# EAGLE design BikeNavigation (EAGLE 7.4.0)
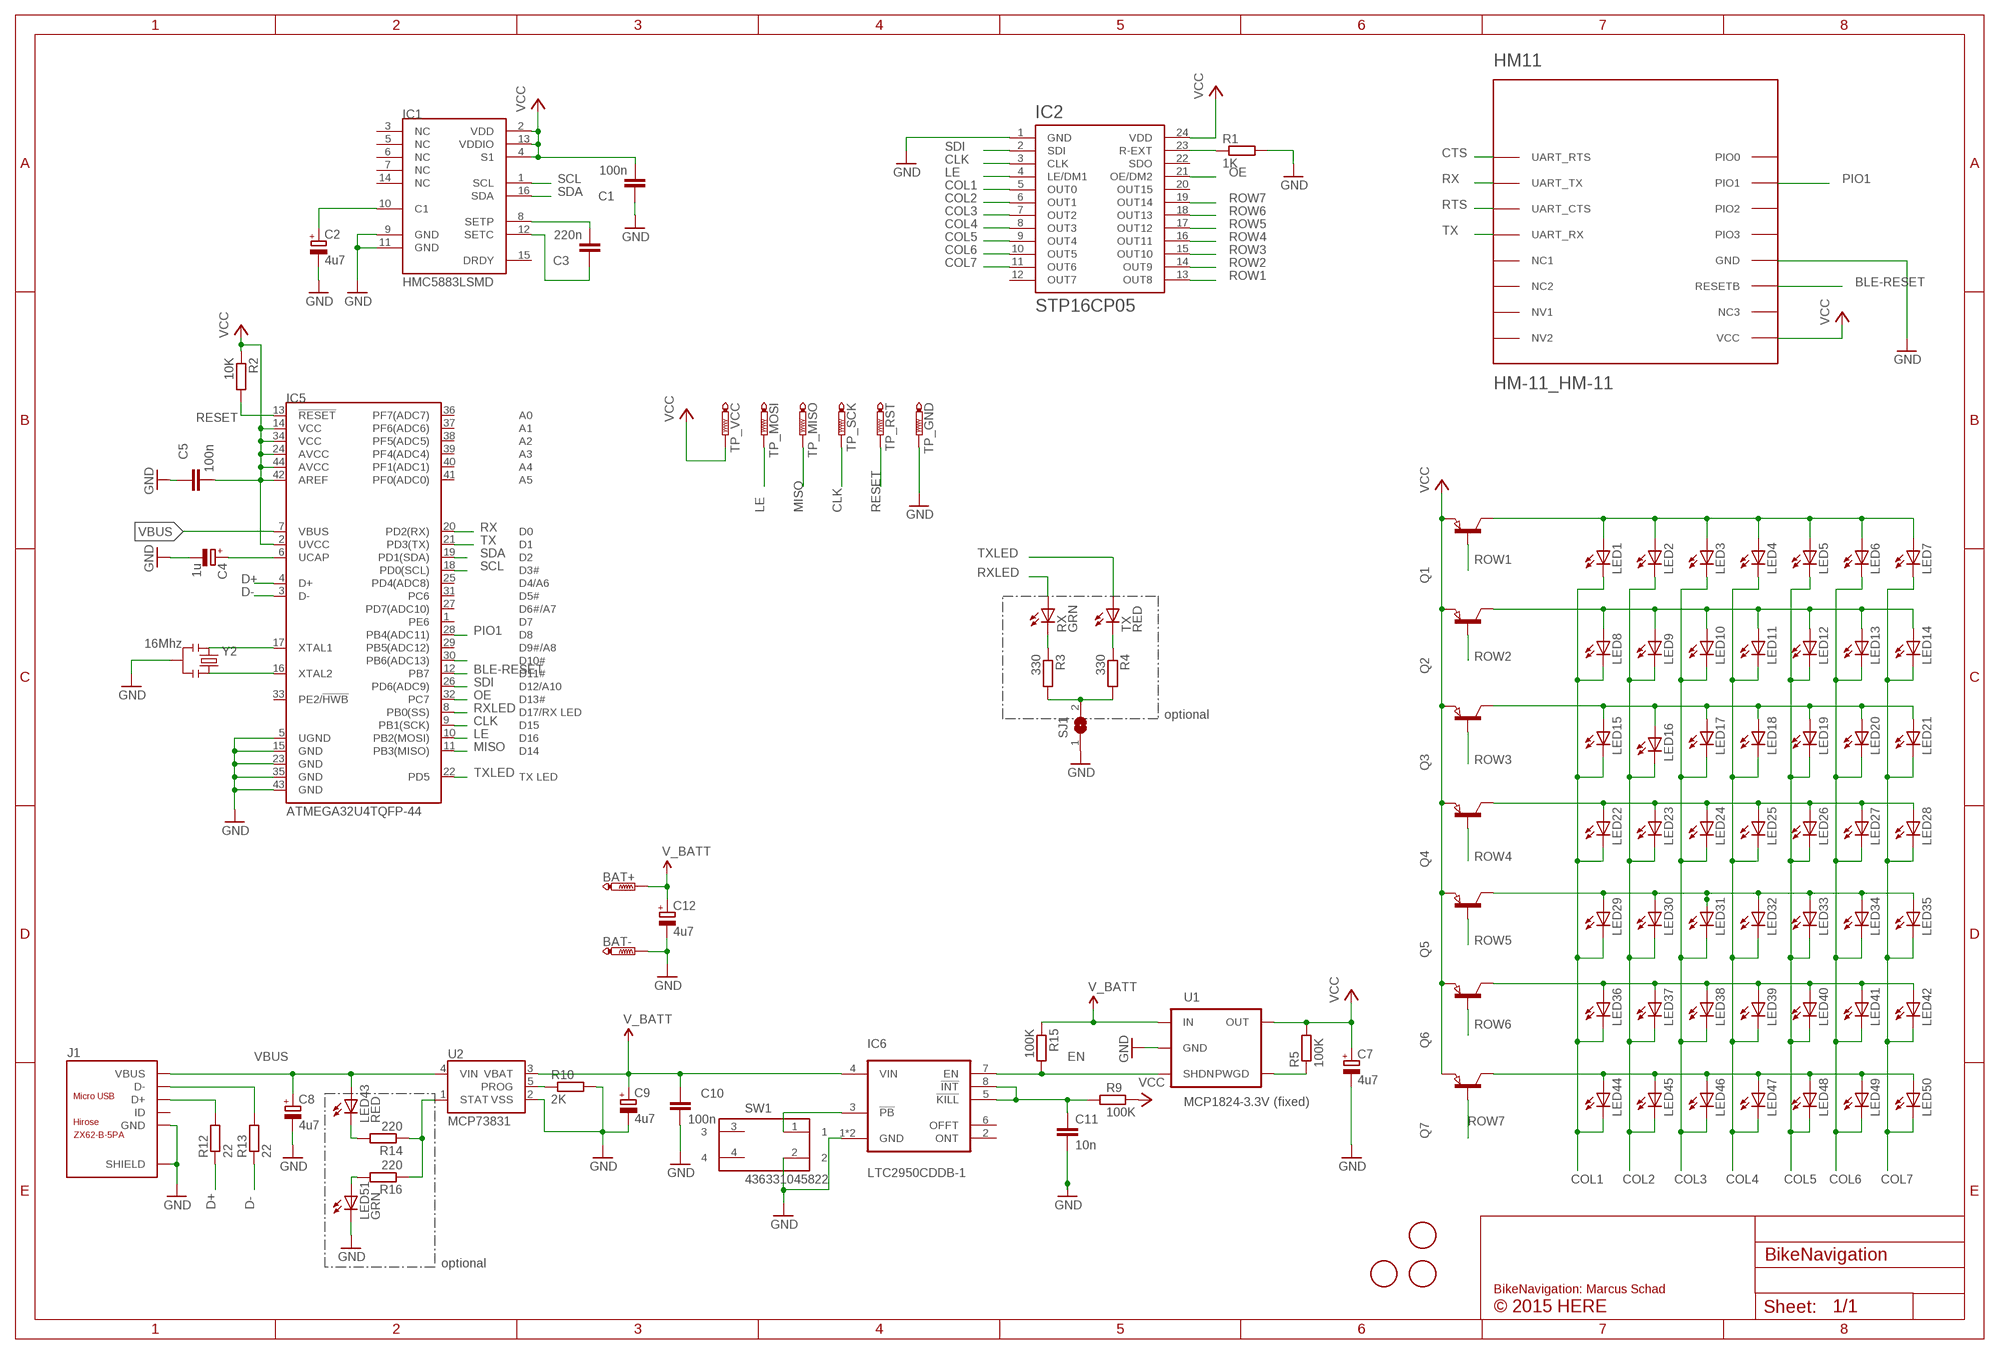
[diagram p0: schematic, sheet 1]

## Parts
BAT+  PTR1TP20SQ  [TP20SQ]
BAT-  PTR1TP20SQ  [TP20SQ]
C1  100n  C-EUC0402  [C0402]
C2  4u7  CPOL-EUSMCA  [SMC_A]
C3  220n  C-EUC0402  [C0402]
C4  1u  CPOL-EUSMCA  [SMC_A]
C5  100n  C-EUC0402  [C0402]
C7  4u7  CPOL-EUSMCA  [SMC_A]
C8  4u7  CPOL-EUSMCA  [SMC_A]
C9  4u7  CPOL-EUSMCA  [SMC_A]
C10  100n  C-EUC0402  [C0402]
C11  10n  C-EUC0402  [C0402]
C12  4u7  CPOL-EUSMCA  [SMC_A]
HM11  HM-11_HM-11  [HM-11_HM-11]
IC1  HMC5883LSMD  [16LPCC]
IC2  STP16CP05  [TSSOP24]
IC5  ATMEGA32U4TQFP-44  [TQFP44]
IC6  LTC2950CDDB-1  LTC2950-1DFN(3X2)  [DDB-8]
J1  MICRO-USB-SMD(ZX62-B-5PA)  [MICRO-USB5+6P-SMD-0.65-AB]
LED1  LEDCHIP-LED0603  [CHIP-LED0603]
LED2  LEDCHIP-LED0603  [CHIP-LED0603]
LED3  LEDCHIP-LED0603  [CHIP-LED0603]
LED4  LEDCHIP-LED0603  [CHIP-LED0603]
LED5  LEDCHIP-LED0603  [CHIP-LED0603]
LED6  LEDCHIP-LED0603  [CHIP-LED0603]
LED7  LEDCHIP-LED0603  [CHIP-LED0603]
LED8  LEDCHIP-LED0603  [CHIP-LED0603]
LED9  LEDCHIP-LED0603  [CHIP-LED0603]
LED10  LEDCHIP-LED0603  [CHIP-LED0603]
LED11  LEDCHIP-LED0603  [CHIP-LED0603]
LED12  LEDCHIP-LED0603  [CHIP-LED0603]
LED13  LEDCHIP-LED0603  [CHIP-LED0603]
LED14  LEDCHIP-LED0603  [CHIP-LED0603]
LED15  LEDCHIP-LED0603  [CHIP-LED0603]
LED16  LEDCHIP-LED0603  [CHIP-LED0603]
LED17  LEDCHIP-LED0603  [CHIP-LED0603]
LED18  LEDCHIP-LED0603  [CHIP-LED0603]
LED19  LEDCHIP-LED0603  [CHIP-LED0603]
LED20  LEDCHIP-LED0603  [CHIP-LED0603]
LED21  LEDCHIP-LED0603  [CHIP-LED0603]
LED22  LEDCHIP-LED0603  [CHIP-LED0603]
LED23  LEDCHIP-LED0603  [CHIP-LED0603]
LED24  LEDCHIP-LED0603  [CHIP-LED0603]
LED25  LEDCHIP-LED0603  [CHIP-LED0603]
LED26  LEDCHIP-LED0603  [CHIP-LED0603]
LED27  LEDCHIP-LED0603  [CHIP-LED0603]
LED28  LEDCHIP-LED0603  [CHIP-LED0603]
LED29  LEDCHIP-LED0603  [CHIP-LED0603]
LED30  LEDCHIP-LED0603  [CHIP-LED0603]
LED31  LEDCHIP-LED0603  [CHIP-LED0603]
LED32  LEDCHIP-LED0603  [CHIP-LED0603]
LED33  LEDCHIP-LED0603  [CHIP-LED0603]
LED34  LEDCHIP-LED0603  [CHIP-LED0603]
LED35  LEDCHIP-LED0603  [CHIP-LED0603]
LED36  LEDCHIP-LED0603  [CHIP-LED0603]
LED37  LEDCHIP-LED0603  [CHIP-LED0603]
LED38  LEDCHIP-LED0603  [CHIP-LED0603]
LED39  LEDCHIP-LED0603  [CHIP-LED0603]
LED40  LEDCHIP-LED0603  [CHIP-LED0603]
LED41  LEDCHIP-LED0603  [CHIP-LED0603]
LED42  LEDCHIP-LED0603  [CHIP-LED0603]
LED43  RED  LEDSML0805  [SML0805]
LED44  LEDCHIP-LED0603  [CHIP-LED0603]
LED45  LEDCHIP-LED0603  [CHIP-LED0603]
LED46  LEDCHIP-LED0603  [CHIP-LED0603]
LED47  LEDCHIP-LED0603  [CHIP-LED0603]
LED48  LEDCHIP-LED0603  [CHIP-LED0603]
LED49  LEDCHIP-LED0603  [CHIP-LED0603]
LED50  LEDCHIP-LED0603  [CHIP-LED0603]
LED51  GRN  LEDSML0805  [SML0805]
Q1  PNP-TRANSISTOR_SOT23  [SOT23]
Q2  PNP-TRANSISTOR_SOT23  [SOT23]
Q3  PNP-TRANSISTOR_SOT23  [SOT23]
Q4  PNP-TRANSISTOR_SOT23  [SOT23]
Q5  PNP-TRANSISTOR_SOT23  [SOT23]
Q6  PNP-TRANSISTOR_SOT23  [SOT23]
Q7  PNP-TRANSISTOR_SOT23  [SOT23]
R1  1K  R-EU_R0402  [R0402]
R2  10K  R-EU_R0402  [R0402]
R3  330  R-EU_R0402  [R0402]
R4  330  R-EU_R0402  [R0402]
R5  100K  R-EU_R0402  [R0402]
R9  100K  R-EU_R0402  [R0402]
R10  2K  R-EU_R0402  [R0402]
R12  22  R-EU_R0402  [R0402]
R13  22  R-EU_R0402  [R0402]
R14  220  R-EU_R0402  [R0402]
R15  100K  R-EU_R0402  [R0402]
R16  220  R-EU_R0402  [R0402]
RX  GRN  LEDCHIP-LED0603  [CHIP-LED0603]
SJ1  SJ  [SJ]
SW1  436331045822  [436331045822]
TP_GND  PTR1TP20SQ  [TP20SQ]
TP_MISO  PTR1TP20SQ  [TP20SQ]
TP_MOSI  PTR1TP20SQ  [TP20SQ]
TP_RST  PTR1TP20SQ  [TP20SQ]
TP_SCK  PTR1TP20SQ  [TP20SQ]
TP_VCC  PTR1TP20SQ  [TP20SQ]
TX  RED  LEDCHIP-LED0603  [CHIP-LED0603]
U1  MCP1824-3.3V (fixed)  V_REG_LDOSMD  [SOT23-5]
U2  MCP73831  [SOT23-5]
U$1  FIDUCIAL  [FIDUCIAL_1MM]
U$2  FIDUCIAL  [FIDUCIAL_1MM]
U$3  FIDUCIAL  [FIDUCIAL_1MM]
Y2  16Mhz  RESONATORSMD  [RESONATOR-SMD]

## Nets
$NS100: LED1.A LED2.A LED3.A LED4.A LED5.A LED6.A LED7.A Q1.3(C)
$NS101: LED8.A LED9.A LED10.A LED11.A LED12.A LED13.A LED14.A Q2.3(C)
$NS102: LED15.A LED16.A LED17.A LED18.A LED19.A LED20.A LED21.A Q3.3(C)
$NS104: LED22.A LED23.A LED24.A LED25.A LED26.A LED27.A LED28.A Q4.3(C)
$NS105: LED29.A LED30.A LED31.A LED32.A LED33.A LED34.A LED35.A Q5.3(C)
$NS107: LED36.A LED37.A LED38.A LED39.A LED40.A LED41.A LED42.A Q6.3(C)
$NS109: LED44.A LED45.A LED46.A LED47.A LED48.A LED49.A LED50.A Q7.3(C)
BLE-RESET: HM11.RESETB IC5.12(PB7)
CLK: IC2.3(CLK) IC5.9(PB1(SCK)) TP_SCK.TP
COL1: IC2.5(OUT0) LED1.C LED8.C LED15.C LED22.C LED29.C LED36.C LED44.C
COL2: IC2.6(OUT1) LED2.C LED9.C LED16.C LED23.C LED30.C LED37.C LED45.C
COL3: IC2.7(OUT2) LED3.C LED10.C LED17.C LED24.C LED31.C LED38.C LED46.C
COL4: IC2.8(OUT3) LED4.C LED11.C LED18.C LED25.C LED32.C LED39.C LED47.C
COL5: IC2.9(OUT4) LED5.C LED12.C LED19.C LED26.C LED33.C LED40.C LED48.C
COL6: IC2.10(OUT5) LED6.C LED13.C LED20.C LED27.C LED34.C LED41.C LED49.C
COL7: IC2.11(OUT6) LED7.C LED14.C LED21.C LED28.C LED35.C LED42.C LED50.C
CTS: HM11.UART_RTS
D+: IC5.4(D+) R12.1
D-: IC5.3(D-) R13.1
EN: IC6.7(EN) R15.2 U1.3(SHDN)
GND: BAT-.TP C1.1 C2.- C4.- C5.1 C7.- C8.- C9.- C10.2 C11.2 C12.- HM11.GND IC1.9(GND) IC1.11(GND) IC2.1(GND) IC5.5(UGND) IC5.15(GND) IC5.23(GND) IC5.35(GND) IC5.43(GND) IC6.1(GND) IC6.TPAD(GND) J1.5(GND) J1.P1(SHIELD) J1.P2(SHIELD) J1.P3(SHIELD) J1.P4(SHIELD) J1.P5(SHIELD) J1.P6(SHIELD) LED51.C R1.2 R10.2 SJ1.1 SW1.2 TP_GND.TP U1.2(GND) U2.2(VSS) Y2.2
LE: IC2.4(LE/DM1) IC5.10(PB2(MOSI)) TP_MOSI.TP
MISO: IC5.11(PB3(MISO)) TP_MISO.TP
N$1: R5.1 U1.4(PWGD)
N$2: R3.1 RX.C
N$3: R4.1 TX.C
N$4: IC2.23(R-EXT) R1.1
N$5: IC5.30(PB6(ADC13))
N$7: R3.2 R4.2 SJ1.2
N$11: C4.+ IC5.6(UCAP)
N$23: LED43.C R14.2
N$26: LED51.A R16.2
N$27: J1.3(D+) R12.2
N$28: C2.+ IC1.10(C1)
N$30: J1.2(D-) R13.2
N$33: IC6.3(!PB) SW1.1
N$34: C11.1 IC6.5(!KILL) IC6.8(!INT) R9.1
N$38: C3.2 IC1.8(SETP)
N$39: C3.1 IC1.12(SETC)
OE: IC2.21(OE/DM2) IC5.32(PC7)
PIO1: HM11.PIO1 IC5.28(PB4(ADC11))
PROG: R10.1 U2.5(PROG)
RESET: IC5.13(!RESET) R2.2 TP_RST.TP
ROW1: IC2.13(OUT8) Q1.1(B)
ROW2: IC2.14(OUT9) Q2.1(B)
ROW3: IC2.15(OUT10) Q3.1(B)
ROW4: IC2.16(OUT11) Q4.1(B)
ROW5: IC2.17(OUT12) Q5.1(B)
ROW6: IC2.18(OUT13) Q6.1(B)
ROW7: IC2.19(OUT14) Q7.1(B)
RTS: HM11.UART_CTS
RX: HM11.UART_TX IC5.20(PD2(RX))
RXLED: IC5.8(PB0(SS)) RX.A
SCL: IC1.1(SCL) IC5.18(PD0(SCL))
SDA: IC1.16(SDA) IC5.19(PD1(SDA))
SDI: IC2.2(SDI) IC5.26(PD6(ADC9))
STAT: R14.1 R16.1 U2.1(STAT)
TX: HM11.UART_RX IC5.21(PD3(TX))
TXLED: IC5.22(PD5) TX.A
V_BATT: BAT+.TP C9.+ C10.1 C12.+ IC6.4(VIN) R15.1 U1.1(IN) U2.3(VBAT)
VBUS: C8.+ IC5.7(VBUS) J1.1(VBUS) LED43.A U2.4(VIN)
VCC: C1.2 C5.2 C7.+ HM11.VCC IC1.2(VDD) IC1.4(S1) IC1.13(VDDIO) IC2.24(VDD) IC5.2(UVCC) IC5.14(VCC) IC5.24(AVCC) IC5.34(VCC) IC5.42(AREF) IC5.44(AVCC) Q1.2(E) Q2.2(E) Q3.2(E) Q4.2(E) Q5.2(E) Q6.2(E) Q7.2(E) R2.1 R5.2 R9.2 TP_VCC.TP U1.5(OUT)
XTAL1: IC5.17(XTAL1) Y2.1
XTAL2: IC5.16(XTAL2) Y2.3
Unconnected: HM11.NC1 HM11.NC2 HM11.NC3 HM11.NV1 HM11.NV2 HM11.PIO0 HM11.PIO2 HM11.PIO3 IC1.3(NC) IC1.5(NC) IC1.6(NC) IC1.7(NC) IC1.14(NC) IC1.15(DRDY) IC2.12(OUT7) IC2.20(OUT15) IC2.22(SDO) IC5.1(PE6) IC5.25(PD4(ADC8)) IC5.27(PD7(ADC10)) IC5.29(PB5(ADC12)) IC5.31(PC6) IC5.33(PE2/!HWB) IC5.36(PF7(ADC7)) IC5.37(PF6(ADC6)) IC5.38(PF5(ADC5)) IC5.39(PF4(ADC4)) IC5.40(PF1(ADC1)) IC5.41(PF0(ADC0)) IC6.2(ONT) IC6.6(OFFT) J1.4(ID) SW1.3 SW1.4

## Notes on the sheet
- optional
- optional
- BikeNavigation: Marcus Schad
- © 2015 HERE

## Library data of the parts
BAT+ BAT- TP_GND TP_MISO TP_MOSI TP_RST TP_SCK TP_VCC = testpad:PTR1: TEST PIN
C1 C3 C5 C10 = Smartprj:C-EU: CAPACITOR, European symbol; PARTNO: 445-3445-1-ND
C2 C4 C7-C9 C12 = rcl:CPOL-EU: POLARIZED CAPACITOR, European symbol
C11 = Smartprj:C-EU: CAPACITOR, European symbol; PARTNO: 445-1260-1-ND
HM11 = BikeNavigation:HM-11_HM-11
IC1 = SparkFun-Sensors:HMC5883L: 3 Axis Digital Compass IC; PROD_ID: IC-10284
IC2 = BikeNavigation:STP16CP05
IC5 = SparkFun-DigitalIC:ATMEGA32U4: Atmel 44-pin 8-bit Microcontroller with 32KBytes of ISP Flash and USB Controller
IC6 = Smartprj:LTC2950-1: LTC2950-1 Push button ON/OFF Controler LINEAR TECHNOLOGY; PARTNO: LTC2950IDDB-1#TRMPBFCT-ND
J1 = Seeed-OPL-Connector:MICRO-USB-SMD(ZX62-B-5PA): 320010005
LED1-LED51 RX TX = led:LED: LED OSRAM: - CHIPLED LG R971, LG N971, LY N971, LG Q971, LY Q971, LO R971, LY R971 LH N974, LH R974 LS Q976, LO Q976, LY Q976 LO Q996 - Hyper CHIPLED LW Q18S LB Q993, LB Q99A, LB R99A - SideLED LS A670, LO A670, LY A670, LG A670, LP A670 LB A673, LV A673, LT A673, LW A673 LH A674 LY A675 LS A676, LA A676, LO A676, LY A676, LW A676 LS A679, LY A679, LG A679 - Hyper Micro SIDELED® LS Y876, LA Y876, LO Y876, LY Y876 LT Y87S - SmartLED LW L88C, LW L88S LB L89C, LB L89S, LG L890 LS L89K, LO L89K, LY L89K LS L896, LA L896, LO L896, LY L896 - TOPLED LS T670, LO T670, LY T670, LG T670, LP T670 LSG T670, LSP T670, LSY T670, LOP T670, LYG T670 LG T671, LOG T671, LSG T671 LB T673, LV T673, LT T673, LW T673 LH T674 LS T676, LA T676, LO T676, LY T676, LB T676, LH T676, LSB T676, LW T676 LB T67C, LV T67C, LT T67C, LS T67K, LO T67K, LY T67K, LW E67C LS E67B, LA E67B, LO E67B, LY E67B, LB E67C, LV E67C, LT E67C LW T67C LS T679, LY T679, LG T679 LS T770, LO T770, LY T770, LG T770, LP T770 LB T773, LV T773, LT T773, LW T773 LH T774 LS E675, LA E675, LY E675, LS T675 LS T776, LA T776, LO T776, LY T776, LB T776 LHGB T686 LT T68C, LB T68C - Hyper Mini TOPLED® LB M676 - Mini TOPLED Santana® LG M470 LS M47K, LO M47K, LY M47K Source: http://www.osram.convergy.de LUXEON: - LUMILED® LXK2-PW12-R00, LXK2-PW12-S00, LXK2-PW14-U00, LXK2-PW14-V00 LXK2-PM12-R00, LXK2-PM12-S00, LXK2-PM14-U00 LXK2-PE12-Q00, LXK2-PE12-R00, LXK2-PE12-S00, LXK2-PE14-T00, LXK2-PE14-U00 LXK2-PB12-K00, LXK2-PB12-L00, LXK2-PB12-M00, LXK2-PB14-N00, LXK2-PB14-P00, LXK2-PB14-Q00 LXK2-PR12-L00, LXK2-PR12-M00, LXK2-PR14-Q00, LXK2-PR14-R00 LXK2-PD12-Q00, LXK2-PD12-R00, LXK2-PD12-S00 LXK2-PH12-R00, LXK2-PH12-S00 LXK2-PL12-P00, LXK2-PL12-Q00, LXK2-PL12-R00 Source: www.luxeon.com KINGBRIGHT: KA-3528ASYC Source: www.kingbright.com
Q1-Q7 = semicon-smd-ipc:PNP-TRANSISTOR_: PNP TRANSISTOR
R1-R5 R10 R12-R14 R16 = rcl:R-EU_: RESISTOR, European symbol
R9 = Smartprj:R-EU_: RESISTOR, European symbol; PARTNO: P510KJCT-ND
R15 = Smartprj:R-EU_: RESISTOR, European symbol; PARTNO: P100KJCT-ND
SJ1 = jumper:SJ: SMD solder JUMPER
SW1 = Kurzhubtaster:436331045822: WS-TUS-3.5x4.7 mm side push SMD Tact Switch with boss design, 4 pins
U1 = SparkFun-PowerIC2:V_REG_LDO: Voltage Regulator LDO Standard 150mA LDO voltage regulator in SOT-23 layout. Micrel part MIC5205. BP (by-pass) pin is used to lower output noise with 470pF cap.
U2 = SparkFun-PowerIC:MCP73831: Miniature single cell, fully integrated Li-Ion, Li-polymer charge management controller http://ww1.microchip.com/downloads/en/DeviceDoc/20001984g.pdf IC-09995; PROD_ID: IC-09995
U$1-U$3 = adafruit:FIDUCIAL: For use by pick and place machines to calibrate the vision/machine, 1mm By microbuilder.eu
Y2 = SparkFun:RESONATOR: Resonator Small SMD resonator. This is the itty bitty 10/20MHz resonators with built in caps. CSTCE10M0G55 and CSTCE20M0V53. Footprint has been reviewed closely but hasn't been tested yet.; PARTNO: *

## Net classes
0 default: width 0.152 mm, drill 0.457 mm, clearance 0.203 mm
2 gnd: width 0.254 mm, drill 0.61 mm, clearance 0.254 mm

## Board
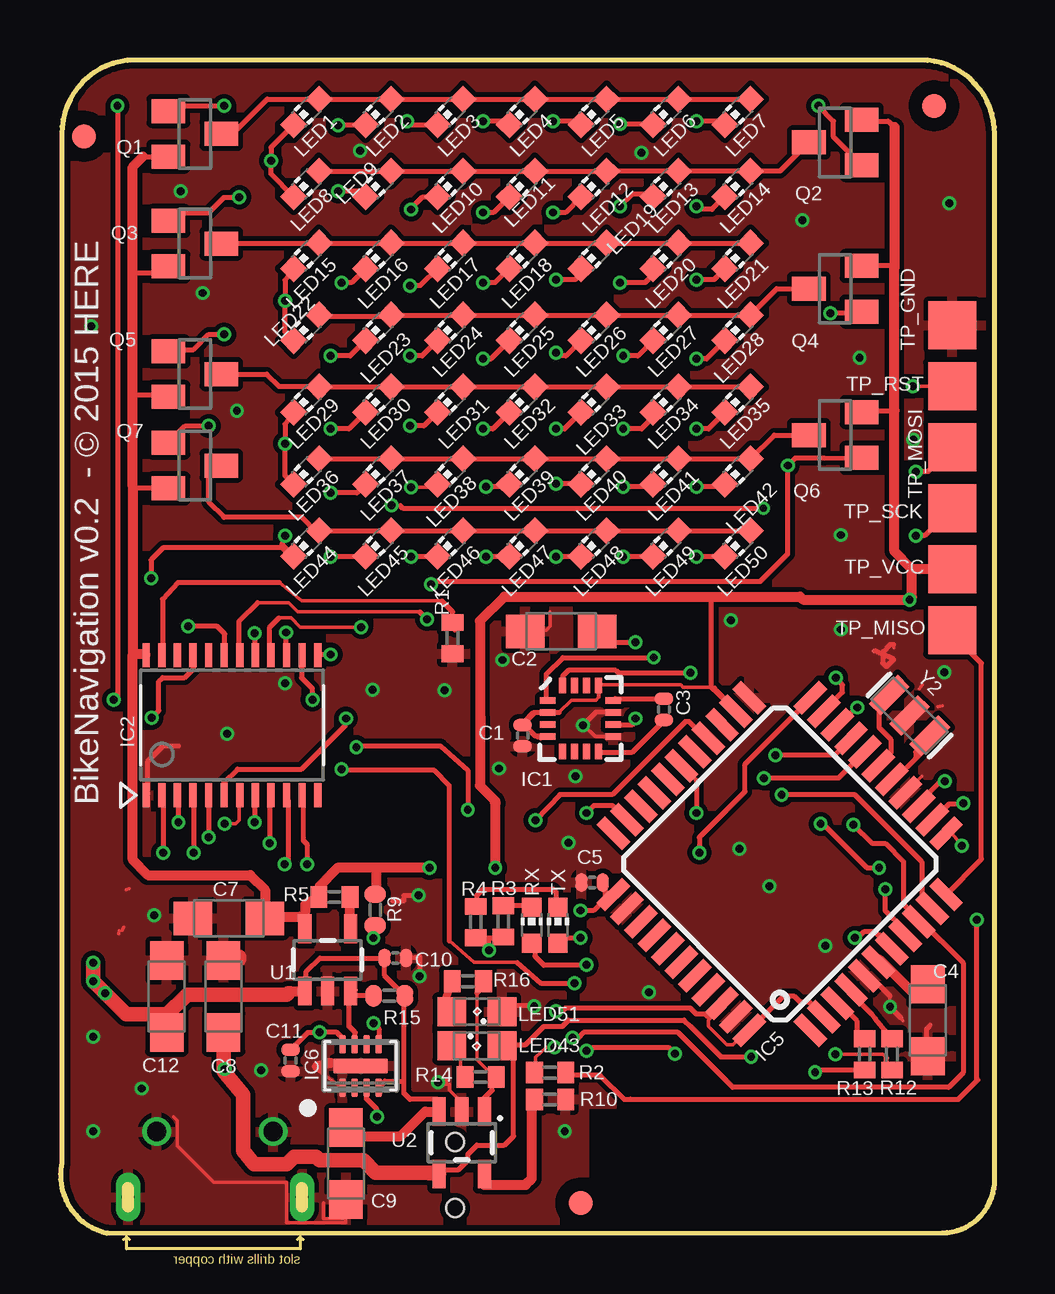
[diagram p1: board, top side]
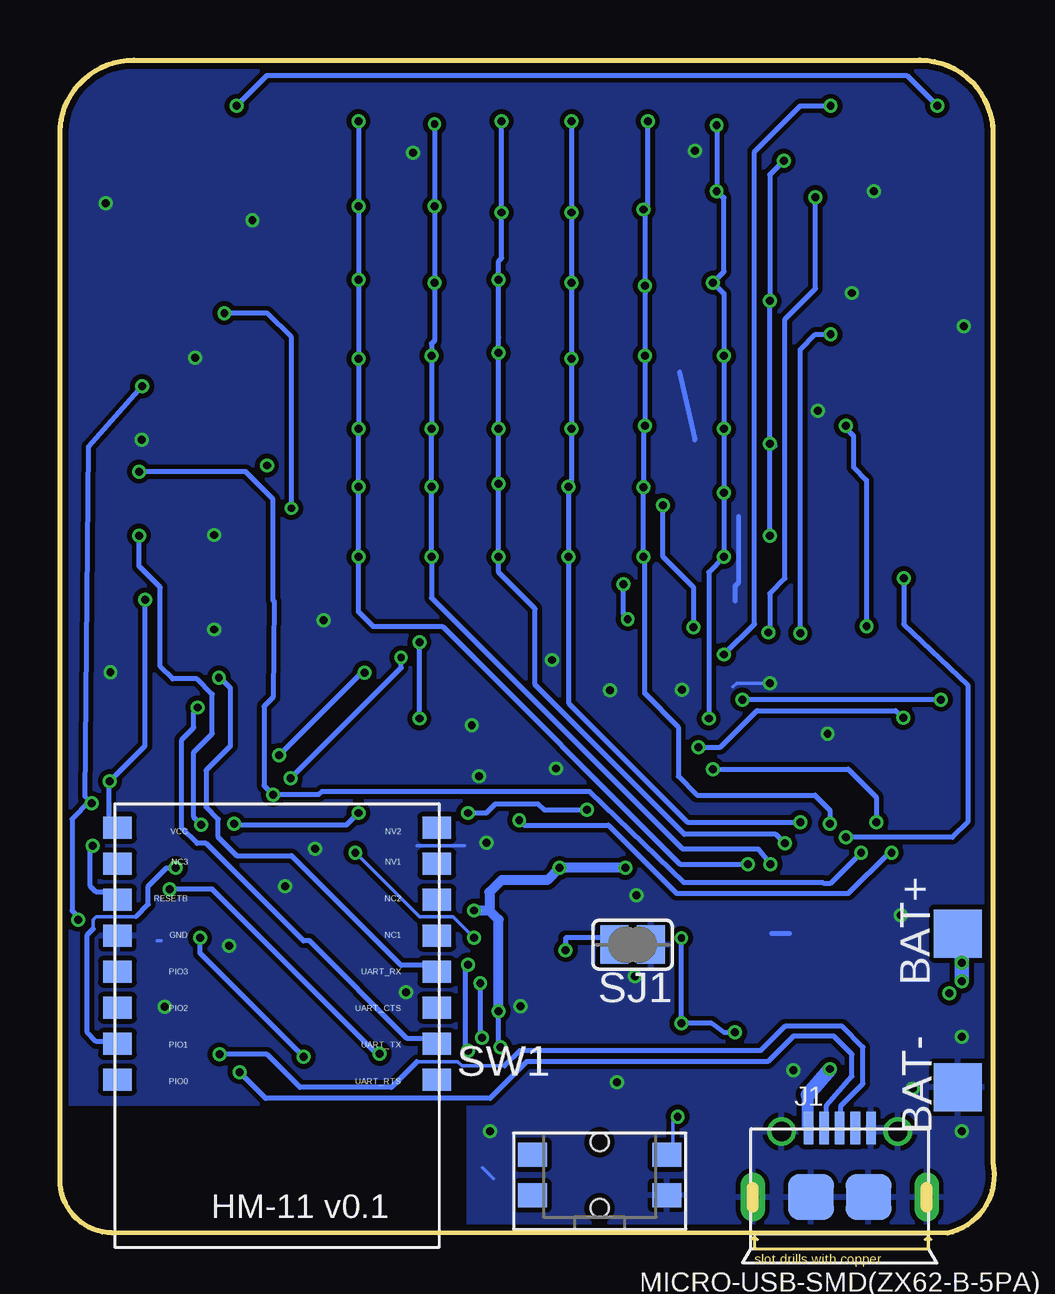
[diagram p2: board, bottom side, seen from below]

Size 38.94 x 48.88 mm. Coordinates in mm from the lower left corner, seen from the top.
Outline: 3.08,48.88 arc90 0.05,45.81 0.05,2.92 arc90 1.95,0 36.76,0.01 arc90 38.94,2.25 38.94,45.8 arc90 35.86,48.88 3.14,48.88 3.08,48.88
Copper layers (1*16): Top 0.018mm / dielectric 1.55mm / Bottom 0.018mm
Design rules "default": minimum track width 0.15mm, minimum drill 0.35mm, track to track 0.15mm, track to pad 0.15mm, pad to pad 0.15mm, via to via 0.15mm, smd to smd 0mil, copper to edge 0.25mm, drill to drill 0.35mm, minimum pad ring 0.175mm, minimum via ring 0.125mm, stop-mask expansion 0mil, vias tented up to drill 0.45mm, thermal gap 0.2mm
bKeepout: area 23.2,0 to 36.7,4.6
tRestrict: area 22.1,-0.4 to 38.8,5.2
bRestrict: area 22,-0.3 to 38.8,5.3

### Footprints (pad centres in the part's own frame; a part is rotated, then mirrored left to right if it is on the bottom)
TP20SQ = smd 2 x 2: TP 0,0
C0402 = smd 0.508 x 0.762: 1 -0.445,0; 2 0.445,0
SMC_A = smd 1.6 x 1.4: + -1.5,0; - 1.5,0
HM-11_HM-11 = smd 1.2 x 0.9: GND 7.508,-0.6; NC1 -5.808,-0.6; NC2 -5.808,-2.1; NC3 7.508,-3.6; NV1 -5.808,-3.6; NV2 -5.808,-5.1; PIO0 7.508,5.4; PIO1 7.508,3.9; PIO2 7.508,2.4; PIO3 7.508,0.9; RESETB 7.508,-2.1; UART_CTS -5.808,2.4; UART_RTS -5.808,5.4; UART_RX -5.808,0.9; UART_TX -5.808,3.9; VCC 7.508,-5.1
16LPCC = smd 0.65 x 0.28: 1 -1.37,0.75; 2 -1.37,0.25; 3 -1.37,-0.25; 4 -1.37,-0.75; 9 1.37,-0.75; 10 1.37,-0.25; 11 1.37,0.25; 12 1.37,0.75 | smd 0.28 x 0.65: 5 -0.75,-1.37; 6 -0.25,-1.37; 7 0.25,-1.37; 8 0.75,-1.37; 13 0.75,1.37; 14 0.25,1.37; 15 -0.25,1.37; 16 -0.75,1.37
TSSOP24 = smd 0.305 x 0.991: 1 -3.575,-2.918; 2 -2.925,-2.918; 3 -2.275,-2.918; 4 -1.625,-2.918; 5 -0.975,-2.918; 6 -0.325,-2.918; 7 0.325,-2.918; 8 0.975,-2.918; 9 1.625,-2.918; 10 2.275,-2.918; 11 2.925,-2.918; 12 3.575,-2.918; 13 3.575,2.918; 14 2.925,2.918; 15 2.275,2.918; 16 1.625,2.918; 17 0.975,2.918; 18 0.325,2.918; 19 -0.325,2.918; 20 -0.975,2.918; 21 -1.625,2.918; 22 -2.275,2.918; 23 -2.925,2.918; 24 -3.575,2.918
TQFP44 = smd 1.5 x 0.5: 1 -5.8,4; 2 -5.8,3.2; 3 -5.8,2.4; 4 -5.8,1.6; 5 -5.8,0.8; 6 -5.8,0; 7 -5.8,-0.8; 8 -5.8,-1.6; 9 -5.8,-2.4; 10 -5.8,-3.2; 11 -5.8,-4; 23 5.8,-4; 24 5.8,-3.2; 25 5.8,-2.4; 26 5.8,-1.6; 27 5.8,-0.8; 28 5.8,0; 29 5.8,0.8; 30 5.8,1.6; 31 5.8,2.4; 32 5.8,3.2; 33 5.8,4 | smd 0.5 x 1.5: 12 -4,-5.8; 13 -3.2,-5.8; 14 -2.4,-5.8; 15 -1.6,-5.8; 16 -0.8,-5.8; 17 0,-5.8; 18 0.8,-5.8; 19 1.6,-5.8; 20 2.4,-5.8; 21 3.2,-5.8; 22 4,-5.8; 34 4,5.8; 35 3.2,5.8; 36 2.4,5.8; 37 1.6,5.8; 38 0.8,5.8; 39 0,5.8; 40 -0.8,5.8; 41 -1.6,5.8; 42 -2.4,5.8; 43 -3.2,5.8; 44 -4,5.8
DDB-8 = smd 0.29 x 0.75: 1 -0.75,-0.9; 2 -0.25,-0.9; 3 0.25,-0.9; 4 0.75,-0.9; 5 0.75,0.9; 6 0.25,0.9; 7 -0.25,0.9; 8 -0.75,0.9 | smd 2.25 x 0.62: TPAD 0,0
MICRO-USB5+6P-SMD-0.65-AB = smd 0.4 x 1.35: 1 -1.3,2.875; 2 -0.65,2.875; 3 0,2.875; 4 0.65,2.875; 5 1.3,2.875 | smd 1.9 x 1.9: P1 -1.2,0; P2 1.2,0 | drill 0.508 pad 1.016 long: P3 -3.625,0; P4 3.625,0 | drill 0.8: P5 -2.425,2.73; P6 2.425,2.73
CHIP-LED0603 = smd 0.8 x 0.8: A 0,-0.75; C 0,0.75
SML0805 = smd 1.2 x 1.2: A 1.05,0; C -1.05,0
SOT23 = smd 1 x 1.4: 1 -0.95,-1.1; 2 0.95,-1.1; 3 0,1.1
R0402 = smd 0.7 x 0.9: 1 -0.65,0; 2 0.65,0
SJ = smd 1.168 x 1.6: 1 -0.762,0; 2 0.762,0
436331045822 = smd 1.2 x 1: 1 2.8,0.85; 2 2.8,-0.85; 3 -2.8,0.85; 4 -2.8,-0.85 | hole 0.75: 0,1.375; 0,-1.375
SOT23-5 = smd 0.55 x 1.2: 1 -0.95,-1.3; 2 0,-1.3; 3 0.95,-1.3; 4 0.95,1.3; 5 -0.95,1.3
FIDUCIAL_1MM = smd 1 x 1: 1 0,0
RESONATOR-SMD = smd 0.7 x 1.7: 1 -1.2,0; 2 0,0; 3 1.2,0

### Placement (x,y rotation side)
BAT+  1.51,12.48 0 bottom
BAT-  1.51,6.08 0 bottom
C1  19.26,20.73 90 top
C2  20.86,25.08 180 top
C3  25.16,21.83 270 top
C4  36.15,8.87 270 top
C5  22.16,14.61 0 top
C7  7.02,13.11 180 top
C8  6.79,9.86 90 top
C9  11.9,2.9 270 top
C10  13.95,11.46 0 top
C11  9.58,7.2 270 top
C12  4.43,9.86 90 top
HM11  29.04,11.79 180 bottom
IC1  21.68,21.45 0 top
IC2  7.15,21.17 0 top
IC5  29.98,15.38 135 top
IC6  12.51,6.97 0 top
J1  6.44,1.51 0 bottom
LED1  10.25,46.72 135 top
LED2  13.24,46.72 135 top
LED3  16.24,46.72 135 top
LED4  19.24,46.72 135 top
LED5  22.23,46.72 135 top
LED6  25.23,46.72 135 top
LED7  28.23,46.72 135 top
LED8  10.25,43.72 135 top
LED9  13.24,43.72 135 top
LED10  16.24,43.72 135 top
LED11  19.24,43.72 135 top
LED12  22.23,43.72 135 top
LED13  25.23,43.72 135 top
LED14  28.23,43.72 135 top
LED15  10.25,40.72 135 top
LED16  13.24,40.72 135 top
LED17  16.24,40.72 135 top
LED18  19.24,40.72 135 top
LED19  22.23,40.72 135 top
LED20  25.23,40.72 135 top
LED21  28.23,40.72 135 top
LED22  10.25,37.73 135 top
LED23  13.24,37.73 135 top
LED24  16.24,37.73 135 top
LED25  19.24,37.73 135 top
LED26  22.23,37.73 135 top
LED27  25.23,37.73 135 top
LED28  28.23,37.73 135 top
LED29  10.25,34.73 135 top
LED30  13.24,34.73 135 top
LED31  16.24,34.73 135 top
LED32  19.24,34.73 135 top
LED33  22.23,34.73 135 top
LED34  25.23,34.73 135 top
LED35  28.23,34.73 135 top
LED36  10.25,31.73 135 top
LED37  13.24,31.73 135 top
LED38  16.24,31.73 135 top
LED39  19.24,31.73 135 top
LED40  22.23,31.73 135 top
LED41  25.23,31.73 135 top
LED42  28.23,31.73 135 top
LED43  17.36,7.81 0 top
LED44  10.25,28.74 135 top
LED45  13.24,28.74 135 top
LED46  16.24,28.74 135 top
LED47  19.24,28.74 135 top
LED48  22.23,28.74 135 top
LED49  25.23,28.74 135 top
LED50  28.23,28.74 135 top
LED51  17.36,9.23 180 top
Q1  5.6,45.8 270 top
Q2  32.29,45.45 90 top
Q3  5.6,41.23 270 top
Q4  32.29,39.35 90 top
Q5  5.6,35.8 270 top
Q6  32.29,33.26 90 top
Q7  5.6,31.99 270 top
R1  16.34,24.8 270 top
R2  20.41,6.69 0 top
R3  18.45,12.99 270 top
R4  17.31,12.96 270 top
R5  11.41,14 180 top
R9  13.12,13.47 90 top
R10  20.41,5.57 0 top
R12  34.65,7.45 270 top
R13  33.51,7.45 270 top
R14  17.51,6.51 180 top
R15  13.7,9.89 180 top
R16  16.98,10.5 180 top
RX  19.64,12.83 0 top
SJ1  15.07,12.02 180 bottom
SW1  16.44,2.42 0 bottom
TP_GND  37.17,37.83 0 top
TP_MISO  37.17,25.13 0 top
TP_MOSI  37.17,32.75 0 top
TP_RST  37.17,35.29 0 top
TP_SCK  37.17,30.21 0 top
TP_VCC  37.17,27.67 0 top
TX  20.74,12.83 0 top
U1  11.13,11.39 0 top
U2  16.72,3.77 180 top
U$1  36.41,46.97 0 top
U$2  0.97,45.7 0 top
U$3  21.68,1.25 0 top
Y2  35.39,21.57 315 top

### Tracks (layer width: path | path; a pad name or v marks a point on that pad's centre or on a via)
$NS100
  Top 0.203: Q1.3 6.72,45.83 7.2,45.83 8.62,47.25 LED1.A LED2.A LED3.A LED4.A LED5.A LED6.A LED7.A
$NS101
  Top 0.203: Q2.3 30,44.25 LED14.A LED13.A LED12.A LED11.A LED10.A LED9.A LED8.A
$NS102
  Top 0.203: Q3.3 6.72,41.26 10.63,41.26 10.63,41.25 LED15.A | LED15.A LED16.A 13.8,41.26 13.8,41.25 LED17.A LED18.A LED19.A LED20.A LED21.A | LED15.A 10.75,41.26
$NS104
  Top 0.203: LED22.A 10.82,38.21 13.8,38.21 13.8,38.23 LED23.A LED24.A LED25.A LED26.A LED27.A LED28.A 29.85,39.35 Q4.3
$NS105
  Top 0.203: Q5.3 8.59,35.8 9.1,35.29 10.75,35.29 | 10.75,35.29 10.88,35.29 10.88,35.16 LED29.A | LED35.A LED34.A LED33.A LED32.A LED31.A LED30.A LED29.A | 10.75,35.29 LED29.A
$NS107
  Top 0.203: LED36.A LED37.A LED38.A LED39.A LED40.A LED41.A LED42.A 29.75,33.26 Q6.3
$NS109
  Top 0.203: Q7.3 6.82,31.87 6.82,31.73 6.18,31.73 6.18,30.46 6.82,29.83 10.07,29.83 10.7,29.19 10.75,29.24 | LED44.A LED45.A LED46.A LED47.A LED48.A LED49.A LED50.A
  Top 0.406: LED44.A 10.75,29.24
BLE-RESET  (via drill 0.33)
  Top 0.152: v37.58,16.14 37.09,16.75 37.02,16.75 36.94,16.67 IC5.12
  Bottom 0.152: 36.56,13.93 HM11.RESETB
  Bottom 0.203: 36.56,13.93 36.84,14.21 37.42,14.21 37.68,14.46 37.68,16.11 v37.58,16.14 37.7,16.06 37.65,16.11
CLK  (via drill 0.33)
  Top 0.152: 19.03,11.29 17.23,11.29 16.21,12.17
  Top 0.203: IC2.3 4.86,18.12 4.91,18.07 v4.91,17.13 | TP_SCK.TP 36.03,29.07 v35.65,29.07 | 21.32,8.11 v21.35,8.14 21.37,8.11 21.55,8.11 21.8,8.36 25.74,8.36 28.03,6.08 37.02,6.08 37.63,6.69 37.63,11.26 35.8,13.09 IC5.9 35.78,13.05 35.14,13.7 35.14,15.48 34.38,16.24 33.84,16.24 v33.05,17.03 | v11.72,19.34 11.77,19.29 15.58,19.29 16.21,18.65 16.21,12.17 | 19.03,11.29 20.02,10.42 v21.42,10.42
  Bottom 0.203: v11.72,19.34 6.08,19.34 4.91,18.17 v4.91,17.13 | v33.05,17.03 33.36,17.33 33.36,20.05 32.6,20.81 32.6,22.46 33.23,23.1 34.25,23.1 34.76,23.6 34.76,26.91 35.65,27.8 v35.65,29.07 | v21.35,8.14 21.42,8.19 v21.42,10.42
COL1  (via drill 0.33)
  Top 0.203: 6.23,18.27 IC2.5 6.18,18.24 v6.18,16.49 | 9.59,30.92 LED36.C 9.36,31.56 v9.36,32.9 9.36,33.71 LED29.C | v3.77,27.29 3.77,28.05 4.28,28.56 9.23,28.56 9.61,28.18 9.74,28.18 LED44.C 9.23,28.69 v9.36,29.07 | LED8.C 8.77,44.13 v8.77,44.69 8.77,45.25 LED1.C | LED22.C 9.36,37.56 v9.36,38.84 9.36,39.71 LED15.C
  Top 0.254: 9.74,43.16 LED8.C
  Bottom 0.203: v8.77,44.69 9.36,44.1 v9.36,38.84 v9.36,32.9 | v9.36,32.9 9.13,32.8 | v3.77,27.29 3.77,25.38 1.1,22.84 1.1,17.13 1.74,16.49 v6.18,16.49 | 9.23,28.96 v9.36,29.07 v9.36,32.9
COL2  (via drill 0.33)
  Top 0.203: LED45.C 12.73,27.87 | IC2.6 6.84,18.27 6.82,18.3 6.82,18.78 7.38,19.34 10.04,19.34 11.9,21.19 v11.9,21.45 | 12.79,28.02 LED45.C | LED9.C 12.49,43.42 v11.57,43.42 | 12.68,46.16 LED2.C 11.59,46.19 v11.57,46.16 | LED16.C 12.13,39.61 v11.72,39.61 | LED37.C 12.35,30.84 v11.26,30.84 | LED45.C 12.68,28.18 v11.26,28.18 | LED23.C 12.07,36.56 v11.26,36.56 | LED30.C 12.02,33.51 v11.26,33.51
  Bottom 0.203: v11.57,46.16 v11.57,43.42 11.31,43.16 11.26,43.16 11.26,40.06 v11.72,39.61 11.26,39.15 v11.26,36.56 v11.26,33.51 v11.26,30.84 v11.26,28.18 11.9,27.54 v11.9,21.45
COL3  (via drill 0.33)
  Top 0.152: v14.61,31.07 15.68,31.07 LED38.C | 15.68,43.11 LED10.C | 15.68,46.16 LED3.C | v6.84,17.05 7.3,17.05 7.45,17.2 7.45,18.12 IC2.7
  Top 0.203: 7.45,18.27 IC2.7 | 15.83,28.02 LED46.C 15.68,28.18 v14.61,28.18 | 15.68,43.11 15.63,43.16 15.07,43.16 14.61,42.71 v14.61,42.65 | v14.44,46.34 14.59,46.19 LED3.C | LED31.C 15.15,33.64 v14.56,33.64 | LED17.C 15,39.48 v14.56,39.48 | LED24.C 15.07,36.56 v14.56,36.56
  Bottom 0.203: v14.44,46.34 14.44,42.83 v14.61,42.65 14.56,42.6 v14.56,39.48 v14.56,36.56 v14.56,33.64 14.61,33.59 v14.61,31.07 v14.61,28.18 14.56,28.18 14.56,22.49 13.17,21.09 13.17,19.03 12.38,18.25 IC2.7 6.84,17.62 v6.84,17.05
COL4  (via drill 0.33)
  Top 0.152: 18.73,46.16 LED4.C
  Top 0.203: 18.88,28.02 LED47.C 18.68,28.18 v17.74,28.18 | IC2.8 8.09,18.21 v8.09,17.13 | LED39.C 18.6,31.1 v17.74,31.1 | LED4.C 18.56,46.34 v17.61,46.34 | LED18.C 18.12,39.61 v17.61,39.61 | LED11.C 18.04,42.53 v17.61,42.53 | LED25.C 17.94,36.43 v17.61,36.43 | LED32.C 18.02,33.51 v17.61,33.51
  Bottom 0.203: v8.09,17.13 12.79,17.13 17.74,22.08 v17.74,28.18 v17.74,31.1 17.74,31.22 17.61,31.35 v17.61,33.51 v17.61,36.43 v17.61,39.61 | v17.61,46.34 v17.61,42.53 v17.61,39.61 | v17.61,39.61 17.61,39.48
COL5  (via drill 0.33)
  Top 0.152: 21.78,40.06 LED19.C | 21.78,46.16 LED5.C
  Top 0.203: IC2.9 8.72,18.2 v8.72,16.24 | LED48.C 21.68,28.18 v20.66,28.18 | LED40.C 21.68,31.22 v20.66,31.22 | LED33.C 21.02,33.51 v20.66,33.51 | LED26.C 21.07,36.56 20.66,36.56 v20.66,36.69 | 21.78,40.06 21.45,39.73 v20.66,39.73 | LED12.C 21.04,42.53 v20.53,42.53 | LED5.C 21.55,46.34 v20.53,46.34
  Bottom 0.203: v8.72,16.24 9.1,16.62 12.91,16.62 19.14,22.84 19.14,26.02 20.66,27.54 v20.66,28.18 v20.66,31.22 v20.66,33.51 v20.66,36.69 | v20.66,36.69 20.66,37.32 | v20.66,36.69 v20.66,39.73 20.66,40.5 20.53,40.62 v20.53,42.53 v20.53,46.34
COL6  (via drill 0.3, 0.33)
  Top 0.152: 24.83,34.12 LED34.C | 24.83,40.06 LED20.C | 24.83,43.11 LED13.C | 24.98,46.01 LED6.C
  Top 0.203: IC2.10 9.43,18.12 9.48,18.07 9.48,15.48 v9.33,15.37 | 24.98,28.02 LED49.C 24.67,28.18 v23.45,28.18 | LED13.C 24.62,43.19 24.53,43.29 23.83,43.29 v23.33,42.78 | LED6.C 24.68,46.21 v23.33,46.21 | 24.83,40.06 24.37,39.61 v23.33,39.61 | 23.43,31.22 23.43,31.12 v23.45,31.1 24.6,31.1 LED41.C | 24.83,34.12 24.22,33.51 v23.45,33.51 | LED27.C 24.06,36.56 v23.45,36.56
  Top 0.406: 24.98,46.21 LED6.C
  Bottom 0.203: v9.33,15.37 9.84,16.01 12.99,16.01 23.45,26.47 v23.45,28.18 v23.45,31.1 v23.45,33.51 v23.45,36.56 23.45,37.07 23.33,37.19 v23.33,39.61 v23.33,42.78 v23.33,46.21
COL7  (via drill 0.33)
  Top 0.152: 28.03,34.12 LED35.C | 28.03,37.17 LED28.C | 27.87,46.16 LED7.C | 27.87,43.26 LED14.C
  Top 0.203: IC2.11 10.04,18.12 10.12,18.04 10.12,16.37 10.27,16.21 v10.27,15.37 | 27.87,46.16 27.7,46.34 v26.5,46.34 | LED14.C 27.16,42.65 26.5,42.65 v26.5,42.78 26.5,42.91 | LED21.C 27.24,39.73 v26.5,39.73 | LED28.C 26.93,36.43 v26.5,36.43 | LED35.C 27.01,33.51 v26.5,33.51 | LED42.C 27.59,31.1 v26.5,31.1 | LED50.C 27.67,28.18 v26.5,28.18
  Bottom 0.203: v10.27,15.37 13.09,15.37 23,25.28 25.89,25.28 26.5,25.89 v26.5,28.18 v26.5,31.1 v26.5,33.51 v26.5,36.43 v26.5,39.73 v26.5,42.78 v26.5,46.34
D+
  Top 0.203: R12.1 33.97,8.94 33.82,9.13 32.95,9.99 IC5.4
D-
  Top 0.203: R13.1 33.21,8.4 33.21,8.82 32.44,9.59 IC5.3
EN
  Top 0.203: 12.02,10.19 U1.3 12.18,10.19 12.13,10.14 12.02,10.14 | IC6.7 12.28,7.89 12.28,8.36 12.02,8.62 12.02,9.89 | R15.2 12.02,9.89 | 12.02,9.89 12.02,10.14 | 12.02,10.14 12.02,10.19 | 12.02,10.19 12.07,10.14 12.28,10.14 12.02,10.4 12.02,10.19
GND  (via drill 0.33)
  Top 0.152: 28.79,22.33 IC5.23 28.64,22.23 28.33,22.54 | 35.9,19.03 35.39,18.52 IC5.15 | 11.52,6.84 11.26,7.09 | IC6.1 11.72,6.08 10.65,6.84 10.68,6.94 | 34.73,24.52 34.73,24.39 | 36.56,21.93 36.76,21.98 | 35.8,22.69 35.92,22.85 | 2.73,14.31 2.85,14.36 | 2.57,12.63 2.64,12.74 | 2.42,12.48 2.45,12.6 | 4.71,4.86 4.86,4.71 4.86,3.64 6.38,2.12 9.43,2.12 9.43,0.44 11.87,0.44 11.87,0.59 10.96,0.59 10.96,1.28 | 35.04,8.97 35.1,8.86 | 33.82,10.65 IC5.5 | v34.58,9.43 34.58,9.89 | 18.27,8.97 18.2,8.97 LED51.C 18.42,9.2 | 20.41,25.89 20.41,25.28 20.25,25.13 19.49,25.13 C2.- | 3.64,18.12 IC2.1 | 9.36,22.69 v9.36,22.92 | v21.78,21.17 22.25,20.7 IC1.9 | IC1.9 22.31,20.68 21.8,21.19 | U2.2 16.6,5.19 16.6,5.57 16.21,5.95 16.21,6.21 15.83,6.21
  Top 0.203: 36.26,8.67 36.1,8.52 36.1,7.45 C4.- | 13.55,6.84 12.63,6.84 IC6.TPAD | 33.92,24.26 34.73,23.91 34.43,23.6 34.27,23.76 34.27,24.21 34.58,24.52 34.73,24.52 | 35.04,8.97 v34.58,9.43 | 33.82,10.65 34.58,9.89 | IC2.1 3.64,18.32 3.64,19.67 4.28,20.3 4.91,20.3 | IC1.11 22.31,21.7 21.8,21.19 | IC1.9 | C10.2 14.97,11.53 v14.97,10.7 | 15.76,6.28 v15.73,6.28 15.71,6.31 | 18.42,9.2 18.73,9.51 19.77,9.51 19.77,9.48 v19.75,9.46 | 13.85,13.85 14.31,13.85 14.31,14.08 v14.92,14.08 | 15.96,6.21 15.83,6.21 15.71,6.21 15.71,6.31 | 16.09,6.33 15.71,6.33 15.71,6.31
  Top 0.406: IC5.43 28.17,9.02 | 33.52,10.75 IC5.5 33.61,10.65 | 11.77,1.51 C9.- | 21.17,5.57 R10.2 | 11.26,7.09 10.68,6.94 | 8.72,4.3 J1.P5
  Top 0.61: C8.- 7.45,11.52 7.45,11.41
  Bottom 0.152: 21.32,2.73 20.86,2.27 | 24.06,16.14 22.08,16.14 | 34.73,12.17 34.88,12.17 | 10.88,22.77 10.73,22.92 v9.36,22.92
  Bottom 0.203: 8.52,12.48 9.28,12.48 | 10.8,26.35 10.8,26.96 10.65,27.11 10.65,29.85 | 13.12,35.87 12.48,33.05
  Bottom 0.406: 8.47,6.84 v8.37,6.79 | 36.41,12.43 HM11.GND
  other vias: 37.04,42.91 1.27,37.79 18.27,19.36 21.47,19.03 5.01,43.42 30.92,42.2 33.31,36.48 35.54,33.05 24.22,45.02 13.01,22.64 3.9,13.24 1.36,8.19 5.93,39.17 12.48,45.09 21.01,4.25 24.52,10.04 28.3,16.01 32.52,29.09 7.35,34.27 31.89,11.97 16.01,22.61 21.17,16.26 6.94,20.81 29.55,14.46 3.39,6.03 1.36,4.25 32.52,25.15 36.84,23.38 27.95,25.53 18.42,23.88
  pour Top: 38.95,0.24 38.95,46.12 arc90 36.31,48.77 2.64,48.99 arc90 0.09,46.45 0.09,0.24 39.2,-0.27 39.2,0.24
  pour Bottom: 0.09,0.24 0.09,46.45 arc-90 2.64,48.99 36.3,48.77 arc-90 38.93,46.1 38.69,0.24
  pour Top: -0.17,14.71 13.04,14.46 13.29,0.24 1.36,0.24 -0.17,1.76
  pour Top: 4.4,22.69 9.89,22.69 9.89,19.64 4.4,19.64
LE  (via drill 0.33)
  Top 0.203: IC2.4 5.47,18.12 5.55,18.04 v5.55,15.86 | TP_MOSI.TP 36.15,31.73 v35.65,31.73 | 36.35,13.5 35.9,13.95 35.9,15.48 33.11,18.27 v30.06,18.27 | 36.41,13.44 36.35,13.5 | 36.35,13.5 IC5.10
  Bottom 0.203: v5.55,15.86 6.82,14.59 7.12,14.59 7.15,14.61 12.94,14.61 16.85,18.4 28.03,18.4 28.15,18.27 v30.06,18.27 30.44,18.65 30.44,21.95 30.06,22.33 30.01,26.32 30.06,26.37 30.06,30.59 31.2,31.73 v35.65,31.73
MISO
  Top 0.203: IC5.11 38.39,15.59 38.39,23.76 37.17,24.98 TP_MISO.TP
N$1
  Top 0.406: U1.4 12.06,12.69 R5.1
N$2
  Top 0.203: RX.C 19.59,13.64 R3.1
N$3
  Top 0.203: R4.1 17.36,13.66 17.36,14.08 17.61,14.33 20.53,14.33 20.66,14.21 20.66,13.57 20.67,13.58 TX.C
N$4
  Top 0.152: 15.88,26.35 10.04,26.35 9.13,27.11
  Top 0.203: 9.13,27.11 4.89,27.11 4.25,26.42 4.25,24.21 IC2.23 | 16.44,25.13 R1.1 | R1.1 16.34,25.19 | R1.1 16.34,25.89 15.88,26.35
N$7  (via drill 0.33)
  Top 0.203: R4.2 17.87,12.3 | 17.87,12.3 18.49,12.3 | R3.2 18.49,12.3 | 18.49,12.3 18.5,12.3 | v17.87,11.79 17.87,12.3
  Bottom 0.203: SJ1.2 16.09,11.77 | 16.32,11.54 16.09,11.77 | 16.09,11.77 16.09,12.05 16.34,12.3 17.87,12.3 v17.87,11.79
N$11
  Top 0.406: C4.+ 36.15,10.14 35.9,10.14 35.65,9.89 34.12,11.41 IC5.6
N$23
  Top 0.152: R14.2 16.67,6.54 16.67,7.83 16.44,7.83 LED43.C
  Top 0.305: LED43.C 16.06,7.5
N$26
  Top 0.305: 16.06,8.77 15.88,8.97 LED51.A 15.91,8.97 15.99,9.28 15.99,9.58 R16.2
N$27  (via drill 0.33)
  Top 0.152: 34.43,7.3 34.27,7.45 v32.29,7.45
  Top 0.203: R12.2 34.43,7.03 34.43,7.3
  Bottom 0.152: 24.06,7.15 22.36,7.15 22.18,6.97 20.41,6.97
  Bottom 0.203: J1.3 6.38,4.43 6.38,5.32 5.47,6.23 5.47,7.75 6.33,8.62 8.72,8.62 9.74,7.6 19.77,7.6 20.41,6.97 | v32.29,7.45 30.31,7.45 28.94,6.08 25.13,6.08 24.06,7.15
N$28  (via drill 0.33)
  Top 0.203: 23.07,21.17 IC1.10 23.83,21.19 23.96,21.32 v23.96,21.45 | C2.+ 22.95,24.62 v23.96,24.62
  Bottom 0.203: v23.96,21.45 v23.96,24.62
N$30  (via drill 0.33)
  Top 0.203: 31.33,6.59 v31.45,6.71 31.54,6.8 R13.2
  Bottom 0.203: J1.2 6.99,4.47 6.99,5.32 5.93,6.54 5.93,7.45 6.69,8.21 8.37,8.21 9.43,7.15 19.49,7.15 21.02,5.62 30.36,5.62 v31.45,6.71
N$33  (via drill 0.33 pad 0.41)
  Top 0.152: 12.79,5.82 IC6.3
  Top 0.203: v13.19,4.86 13.19,4.91 13.17,4.94 13.17,5.19 12.76,5.6 IC6.3
  Bottom 0.152: v13.19,4.86 13.24,4.86 13.4,4.71 13.4,3.34 13.55,3.18 SW1.1
N$34  (via drill 0.3, 0.33)
  Top 0.203: 11.75,7.86 IC6.8 11.77,7.88 11.77,8.11 11.52,8.36 v10.8,8.36 | v10.8,8.36 10.75,8.36 | IC6.5 13.29,7.9 13.29,8.49 v13.04,8.75 | C11.1 10.31,8.36 v10.8,8.36 | R9.1 13.04,12.82 v13.04,12.3
  Bottom 0.203: v10.8,8.36 11.26,8.36 11.77,8.75 v13.04,8.75 v13.04,12.3
N$38
  Top 0.152: 22.44,20.05 IC1.8
  Top 0.203: IC1.8 22.45,20.05 23.83,20.05 25.1,21.32 25.1,21.33 C3.2
N$39
  Top 0.203: IC1.12 23.12,22.27 C3.1
OE  (via drill 0.33)
  Top 0.203: v21.93,17.51 22.23,17.81 23,17.81 23.61,17.2 IC5.32 | 5.47,24.06 IC2.21 5.55,24.11 | v3.79,21.47 4.1,21.78 4.1,22.99 4.25,23.15 5.17,23.15 5.55,23.53 5.55,24.11 | v12.33,20.25 12.38,20.3 15.83,20.3 16.98,19.29 v16.98,17.64 | 5.55,24.11
  Bottom 0.203: v21.93,17.51 21.17,17.51 20.79,17.89 19.01,17.89 18.75,17.64 v16.98,17.64 | v3.79,21.47 4.1,21.78 9.89,21.78 11.41,20.25 v12.33,20.25
PIO1  (via drill 0.33)
  Top 0.152: 26.5,18.88 IC5.28
  Top 0.203: 26.5,18.88 v26.5,17.51 | v31.68,17.05 31.78,17.05 33.61,15.22 v34.12,15.22
  Bottom 0.152: 36.41,7.91 HM11.PIO1 | 37.55,12.68 37.55,13.06 37.42,13.19 35.77,13.19
  Bottom 0.203: v26.5,17.51 27.01,17 31.63,17 v31.68,17.05 | 36.41,7.91 36.48,7.98 37.42,7.98 37.8,8.36 37.8,12.43 37.55,12.68 | v34.12,15.22 34.5,15.22 35.26,14.46 35.26,13.7 35.77,13.19
PROG
  Top 0.152: U2.5 17.66,1.96 17.66,2.01
  Top 0.406: 17.61,2.24 17.66,2.01 19.39,2.01 19.64,2.27 19.64,5.32 R10.1
RESET  (via drill 0.33)
  Top 0.152: TP_RST.TP v35.52,35.29 | 36.41,17.25 IC5.13 | 21.17,6.84 21.02,6.84 21.02,6.69 R2.2 | 23.76,5.62 23.76,5.57
  Top 0.203: 21.17,6.84 20.91,6.59 22.49,6.59 23.5,5.57 23.76,5.57 37.42,5.57 38.24,6.38 38.19,6.43 v38.19,13.06 | 36.41,17.25 37.04,17.89 37.68,17.89 37.65,17.91 v37.63,17.91
  Bottom 0.152: v37.63,17.91 37.88,18.17
  Bottom 0.203: v35.52,35.29 37.75,32.77 37.88,18.17 | 37.68,17.91 v37.63,17.91 37.63,17.97 37.68,18.02 38.44,17.25 38.44,13.44 38.19,13.19 v38.19,13.06
ROW1  (via drill 0.33)
  Top 0.203: Q1.1 4.72,46.97 v6.82,46.97 | IC2.13 10.75,24.11 v11.26,24.11
  Bottom 0.203: v6.82,46.97 8.09,46.97 9.99,45.07 9.99,25.38 v11.26,24.11
ROW2  (via drill 0.33)
  Top 0.203: IC2.14 10.04,24.06 10.04,23.15 10.5,22.69 v10.5,22.23 | Q2.1 32.22,45.67 32.22,46.34 v31.58,46.97 | v2.37,46.97 2.37,22.21 v2.22,22.23
  Bottom 0.203: v2.22,22.23 v10.5,22.23 | v31.58,46.97 30.31,48.24 3.64,48.24 v2.37,46.97
ROW3  (via drill 0.33)
  Top 0.152: 9.43,24.06 IC2.15
  Top 0.203: Q3.1 4.84,42.53 6.18,42.53 6.82,43.16 v7.45,43.16 | 9.43,24.06 9.41,24.09 v9.41,25.03
  Bottom 0.203: v7.45,43.16 7.45,39.35 8.72,38.08 8.72,27.29 9.36,26.65 9.36,25 9.38,25 v9.41,25.03
ROW4  (via drill 0.3, 0.33)
  Top 0.152: 14.16,30.31 v13.8,30.34 | 8.82,24.21 IC2.16 | 9.1,25.64 9.61,25.64 9.99,25.26 v12.53,25.26
  Top 0.203: 8.82,24.21 8.72,24.24 8.72,25.26 9.1,25.64 | Q4.1 33.33,38.34 v32.09,38.34 | 14.16,30.31 14.26,30.21 v29.3,30.21
  Bottom 0.203: v13.8,30.34 13.8,28.18 12.53,26.91 v12.53,25.26 | v29.3,30.21 29.3,37.32 30.31,38.34 v32.09,38.34
ROW5  (via drill 0.33)
  Top 0.203: v8.09,25 8.09,24.11 IC2.17 | Q5.1 4.56,36.81 5.55,36.81 6.18,37.45 v6.82,37.45
  Bottom 0.203: v6.82,37.45 7.45,37.45 8.09,36.81 v8.09,25
ROW6  (via drill 0.33)
  Top 0.152: 14.97,25.89 9.89,25.89 9.51,26.27 8.21,26.27
  Top 0.203: IC2.18 7.45,24.21 7.45,25.51 8.21,26.27 | v15.27,25.59 14.97,25.89 | Q6.1 31.84,32.29 30.62,32.29 v30.31,31.99 30.31,28.3 29.17,27.16 15.58,27.16 v15.45,27.03
  Bottom 0.203: v15.27,25.59 15.45,25.76 v15.45,27.03
ROW7  (via drill 0.33)
  Top 0.203: v5.32,25.28 6.54,25.28 6.84,24.98 6.84,24.21 IC2.19 | Q7.1 5.2,33.64 v6.18,33.64
  Bottom 0.203: v5.32,25.28 5.32,31.38 5.85,31.91 5.85,33.21 6.18,33.54 v6.18,33.64
RX  (via drill 0.33)
  Top 0.203: v33.21,21.9 32.7,21.45 32.45,21.32 IC5.20
  Bottom 0.203: HM11.UART_TX 23.3,7.91 23.5,8.11 24.47,8.11 28.53,12.17 28.79,12.17 32.85,16.24 33.23,16.24 33.87,16.87 33.87,20.56 33.36,21.06 33.36,21.7 33.21,21.85 v33.21,21.9
RXLED  (via drill 0.33)
  Top 0.152: 34.73,13.09 35.19,12.63 35.19,12.33 IC5.8
  Top 0.203: 34.73,13.09 34.38,13.44 v34.38,14.33 | RX.A 19.77,11.96 19.77,11.54 20.15,11.16 20.18,11.18 v21.93,11.18 | v25.61,7.48 25.36,7.73 22.18,7.73 22.06,7.6 v21.93,7.6
  Bottom 0.203: 34.38,14.26 34.43,14.31 34.4,14.33 v34.38,14.33 | v34.38,14.33 32.6,14.33 25.87,7.6 v25.61,7.48 | 34.38,14.26 34.38,14.21 | 34.38,14.26 v34.38,14.33 | v21.93,11.18 22.06,11.06 22.06,7.86 21.93,7.73 v21.93,7.6
SCL  (via drill 0.3, 0.33)
  Top 0.203: IC1.1 20.25,22.25 20.25,23.3 20.94,23.99 v24.72,23.99 | IC5.18 32.42,18.96 v29.32,18.96
  Bottom 0.203: v29.32,18.96 24.72,23.55 v24.72,23.99
SDA  (via drill 0.33)
  Top 0.203: IC1.16 20.93,23.21 21.17,23.45 23.15,23.45 23.25,23.35 v26.25,23.35 | IC5.19 32.26,19.92 v29.8,19.92
  Top 0.254: 20.91,22.84 IC1.16
  Bottom 0.203: v29.8,19.92 26.37,23.35 v26.25,23.35
SDI  (via drill 0.33)
  Top 0.203: IC2.2 4.25,18.12 4.28,18.09 v4.28,15.86 | v19.8,17.2 20.81,18.27 23,18.27 26.04,21.32 26.2,21.32 26.96,20.56 IC5.26
  Bottom 0.203: v4.28,15.86 4.38,15.86 6.08,14.16 13.24,14.16 16.09,17 19.59,17 v19.8,17.2
STAT
  Top 0.152: 17.36,10.19 R16.1 | 18.04,6.46 R14.1 | R14.1 18.2,6.54 18.2,6.76 17.81,6.76 17.36,7.22 17.36,10.02 | 18.2,6.46 R14.1 | 17.66,5.62 U2.1
  Top 0.203: 17.36,10.02 17.48,10.14 17.48,10.4 17.59,10.5 R16.1 | 17.66,5.62 17.99,5.95 17.99,6.46 18.04,6.46
  Top 0.305: 17.66,5.55 17.66,5.32 U2.1
TX  (via drill 0.33)
  Top 0.152: 31.84,21.78 IC5.21
  Top 0.203: 31.84,21.78 32.6,22.54 32.6,22.84 32.34,23.1 32.32,23.12 | 32.22,23.22 32.32,23.12 | 32.32,23.12 v32.32,23.15
  Bottom 0.152: 23.3,10.96 HM11.UART_RX
  Bottom 0.203: 23.3,10.96 23.5,11.16 24.72,11.16 29.3,15.73 31.58,15.73 32.34,16.49 32.34,17.25 32.85,17.76 32.85,19.29 31.84,20.3 31.84,22.72 32.27,23.15 v32.32,23.15
TXLED  (via drill 0.33)
  Top 0.203: IC5.22 31.26,22.26 28.53,19.54 28.53,18.4 26.63,16.49 v26.63,15.86 | TX.A 20.95,12.3 v21.68,12.3
  Bottom 0.152: v21.68,12.3 22.56,13.19 23.96,13.19 v26.63,15.86
V_BATT  (via drill 0.33)
  Top 0.152: 15.76,5.14 U2.3
  Top 0.203: U1.1 10.19,10.25 10.25,10.3 10.25,10.9 10.8,11.46 C10.1 13.51,10.73 R15.1 14.31,9.89 14.31,6.33 | 15.83,5.57 15.77,5.51 | IC6.4 13.52,6.33 14.31,6.33 | 15.77,5.51 15.71,5.57 14.56,5.57 14.31,5.82 14.31,6.33 | 1.74,10.12 1.74,10.02 1.36,10.4 v1.36,10.5 1.36,10.52 | 15.77,5.51 U2.3 15.83,5.06
  Top 0.254: 13.29,5.82 IC6.4
  Top 0.406: C9.+ 12.02,4.3 12.02,3.79 12.28,4.05 14.18,4.05 15.2,5.07 U2.3 | 9.48,9.99 9.58,10.09 U1.1 | 11.77,4.55 11.46,4.86
  Top 0.61: 11.77,4.55 C9.+ | 9.48,9.99 9.43,9.94 5.27,9.94 4.43,9.1 | v1.36,10.5 v1.86,9.99 2.73,9.13 4.4,9.13 4.43,9.1 | 4.43,9.1 C12.+ | v1.36,10.5 1.74,10.12 | v1.36,11.26 v1.36,10.5
  Bottom 0.61: v1.36,10.5 1.36,12.43 1.56,12.43 | BAT+.TP 1.56,12.43 | 1.56,12.43 1.61,12.43
VBUS  (via drill 0.33)
  Top 0.152: 34.58,12.02 IC5.7
  Top 0.203: 18.83,7.42 LED43.A 18.46,7.86 18.63,7.86 | 18.75,7.86 19.39,7.86 20.15,8.62 20.91,8.62 21.17,8.87 25.99,8.87 26.25,8.62 26.37,8.49 27.52,7.35 v28.79,7.35 | 18.88,7.6 18.63,7.86 | 34.58,12.02 34.17,12.43 | IC5.7 33.94,12.56 33.49,12.56 33.23,12.3 v33.11,12.3 | 18.75,7.86 18.88,7.73 18.88,4.05 18.5,3.67 17.36,3.67 16.98,3.28 16.98,3.03 16.6,2.65 15.95,2.65 U2.4 | 18.75,7.86 18.63,7.86
  Top 0.61: U2.4 15.36,2.5 15.34,2.52 | 6.79,6.74 7.6,5.77 7.6,3.44 8.06,2.88 9.43,2.88 9.74,3.18 10.65,3.18 10.8,3.03 12.63,3.03 13.14,2.52 15.34,2.52 | 6.79,6.74 C8.+ | 6.79,6.74 v6.84,6.84 | 15.34,2.52 15.58,2.52
  Bottom 0.203: v28.79,7.35 33.11,11.67 v33.11,12.3
  Bottom 0.457: J1.1 7.76,4.4
  Bottom 0.508: 7.76,4.4 7.76,5.77
  Bottom 0.61: 7.76,5.77 v6.84,6.84
VCC  (via drill 0.33)
  Top 0.152: 35.9,18.02 IC5.14 | TP_VCC.TP 36.15,27.67 | IC5.44 28.53,8.36 28.03,7.86 27.77,7.86 27.01,8.62 27.01,8.87 27.52,9.38 IC5.42 | 31.68,8.97 IC5.2 | v20.58,7.75 20.25,7.75 19.8,7.32 19.8,6.69 R2.1 | 22.62,13.85 22.69,13.77 23,14.08 IC5.34 | 22.62,14.61 C5.2 | 22.43,22.32 22.31,22.21 21.29,22.21 20.79,21.7 | 22.43,22.32 IC1.13 | 22.43,22.32 22.44,22.33 22.44,22.84 25.87,22.84 25.95,22.76 27.14,22.76
  Top 0.203: IC1.4 20.29,20.71 19.95,20.71 | 19.95,20.71 19.8,20.71 19.34,21.17 | 19.34,21.17 19.33,21.18 C1.2 19.39,21.31 19.39,21.32 19.77,21.7 IC1.2 | 22.43,22.88 IC1.13 | 19.34,21.17 19.34,21.32 19.72,21.7 IC1.2 | v35.39,26.4 35.49,26.5 | 3.64,24.06 IC2.24 3.54,24.11 | 10.04,13.24 10.19,13.39 | 10.04,13.24 U1.5 | 10.8,14.46 10.8,14 R5.2 | 3.01,31.1 3.07,31.04 4.13,31.04 4.25,30.92 | 3.43,44.85 Q1.2 | Q3.2 4.2,39.99 3.01,39.99 | Q5.2 4.44,34.91 3.01,34.91 | Q2.2 33.45,46.34 34.5,46.34 34.76,46.08 | 34.76,40.24 34.7,40.3 Q4.2 | Q6.2 33.46,34.27 34.76,34.27 | IC1.2 20.79,21.7 | 22.62,13.85 22.21,13.44 v21.68,13.44 | 22.62,14.61 22.69,14.54 22.69,13.77 22.69,13.7 | IC5.44 30.14,9.89 30.57,9.89 30.82,9.63 31.2,9.63 IC5.2 | 35.9,18.02 36.66,18.78 36.79,18.78 | 36.79,18.78 36.92,18.78 | 36.92,18.78 36.92,18.91 36.79,18.78 | v36.86,18.83 36.92,18.78 | 27.26,22.63 IC5.24 28.14,21.83 27.26,22.72 27.26,22.63 | IC5.42 27.01,9.02 27.01,9 26.88,9.13 26.5,9.13 26.25,9.38 21.04,9.38 20.91,9.25 v20.66,9.25 | C7.+ 8.6,13.19 | 10.04,13.24 9.99,13.19 | 19.95,20.71 20.02,20.63 20.02,20.68 19.9,20.68 | 27.26,22.63 27.14,22.76 27.14,26.4 30.69,26.4 30.82,26.53 | 17.48,25.51 17.61,21.18
  Top 0.254: 33.58,40.17 33.29,40.3 Q4.2
  Top 0.406: 36.15,27.67 35.49,27.67 | 4.22,34.85 Q5.2 | Q7.2 4.33,30.84 4.25,30.92 | C7.+ 8.52,14.31 7.91,14.92 3.64,14.92 3.01,15.55 3.01,24.11 | 35.49,26.5 35.49,27.67 | 10.19,13.39 10.19,13.7 10.8,14 | 10.8,14.46 11.11,14.77 11.08,14.77 11.54,15.22 13.17,15.22 | v15.38,15.22 13.17,15.22 | 3.54,24.11 3.01,24.11 | 3.43,44.85 3.01,44.43 3.01,39.99 3.01,34.91 3.01,31.1 3.01,24.11 | 34.76,46.08 34.76,40.24 34.76,34.27 34.76,28.41 35.49,27.67 | v35.39,26.4 30.95,26.4 30.82,26.53 18.5,26.53 17.48,25.51 17.48,18.65 18.12,18.02 18.12,17.89 | 8.6,13.19 9.99,13.19 | 18.12,17.89 v18.12,15.22 | 18.14,17.91 18.12,17.89 | R9.2 13.17,14.12 13.17,15.22
  Bottom 0.152: 36.92,17 36.66,16.75 HM11.VCC 36.41,16.9
  Bottom 0.203: 36.92,17 36.92,18.78 v36.86,18.83 35.39,20.3 v35.39,26.4 | v20.58,7.75 20.66,7.81 v20.66,9.25
  Bottom 0.406: v20.66,9.25 20.66,13.06 21.04,13.44 | v15.38,15.22 v18.12,15.22 18.63,14.71 20.53,14.71 21.04,14.21 21.04,13.44 | 21.04,13.44 v21.68,13.44
XTAL1
  Top 0.203: IC5.17 34.63,20.03 34.63,20.56 34.12,21.06 34.12,22.08 34.38,22.33 34.46,22.33 | 34.46,22.33 34.63,22.33 34.63,22.59 | Y2.1 34.46,22.33
XTAL2
  Top 0.203: 34.88,19.03 35.65,19.79 | 35.65,19.79 35.9,20.05 | 35.9,20.3 35.9,20.56 36.15,20.81 36.15,20.56 35.9,20.3 | 35.9,20.3 35.9,20.05 | 35.9,20.05 35.65,20.05 | 35.9,20.3 35.65,20.05 | 35.65,20.05 35.65,19.79
  Top 0.305: 34.88,19.03 IC5.16 | 35.9,20.3 Y2.3

### Text on the board
tNames: BikeNavigation v0.2 - © 2015 HERE